# Altium schematic sheet SNC8600BMT03_SCH_v1.0.SchDoc: 1234
size A3
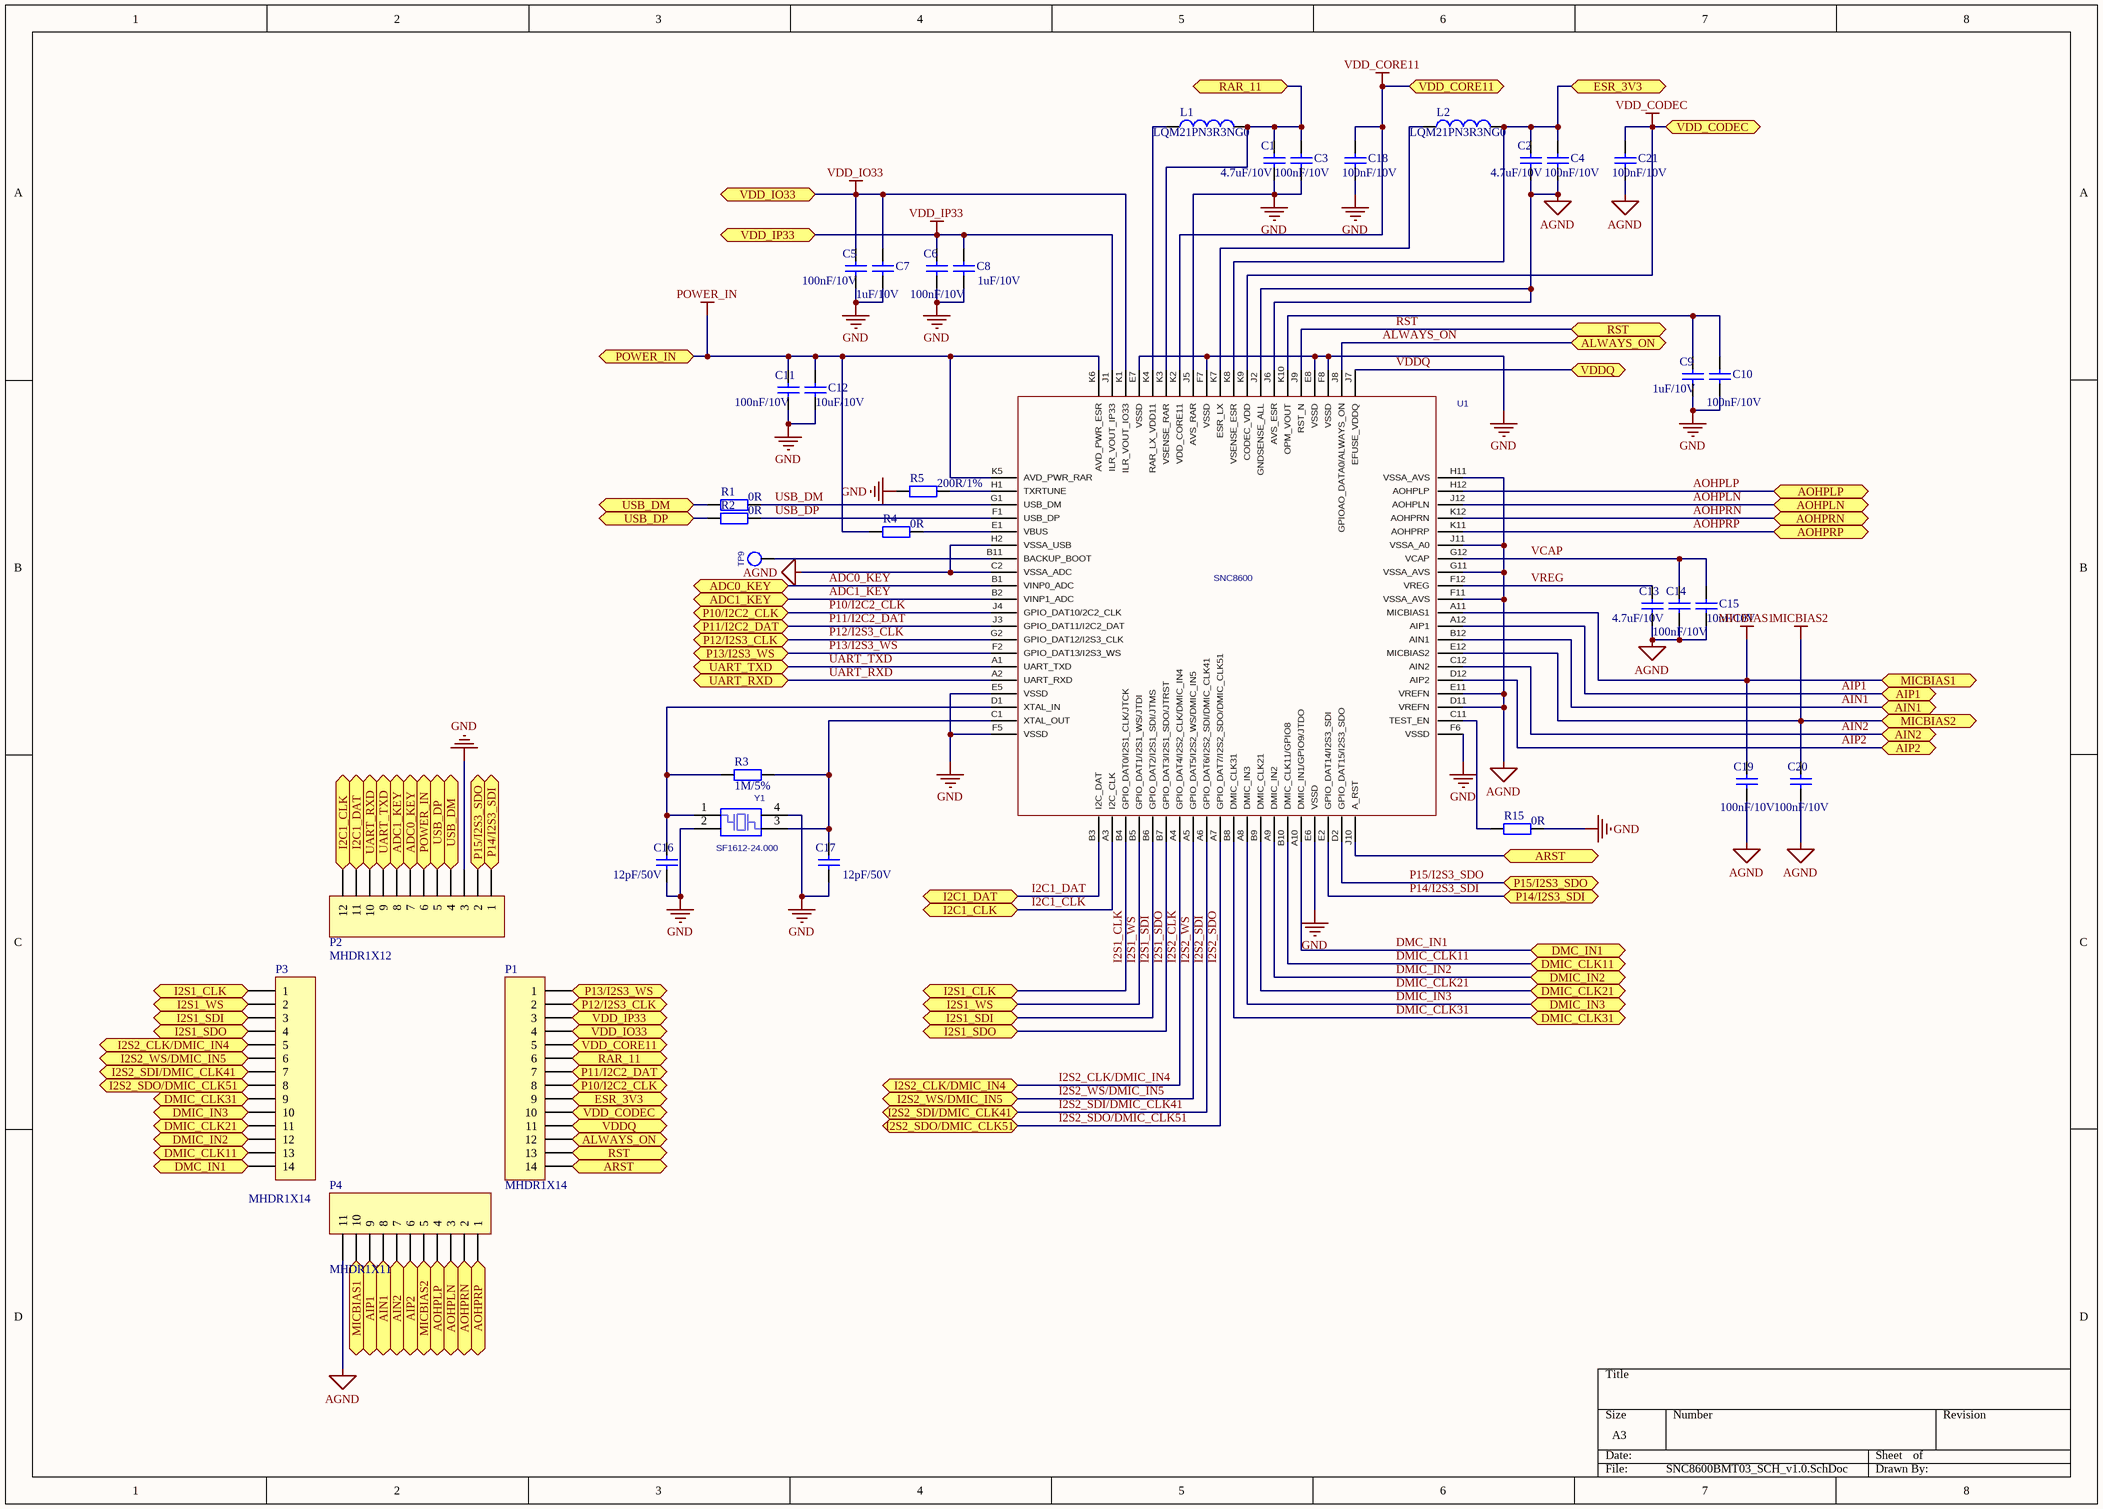
[diagram p0: SNC8600BMT03_SCH_v1.0.SchDoc]

## Parts
C1  4.7uF/10V  [C0402]
C2  4.7uF/10V  [C0402]
C3  100nF/10V  [C0402]
C4  100nF/10V  [C0402]
C5  100nF/10V  [C0402]
C6  100nF/10V  [C0402]
C7  1uF/10V  [C0402]
C8  1uF/10V  [C0402]
C9  1uF/10V  [C0402]
C10  100nF/10V  [C0402]
C11  100nF/10V  [C0402]
C12  10uF/10V  [C0402]
C13  4.7uF/10V  [C0402]
C14  100nF/10V  [C0402]
C15  10uF/10V  [C0402]
C16  12pF/50V  [0201]
C17  12pF/50V  [0201]
C18  100nF/10V  [C0402]
C19  100nF/10V  [C0402]
C20  100nF/10V  [C0402]
C21  100nF/10V  [C0402]
L1  LQM21PN3R3NG0  [L0805]
L2  LQM21PN3R3NG0  [L0805]
P1  MHDR1X14  [MHDR1X14]
P2  MHDR1X12  [MHDR1X12]
P3  MHDR1X14  [MHDR1X14]
P4  MHDR1X11  [MHDR1X11]
R1  0R  [R0402]
R2  0R  [R0402]
R3  1M/5%  [R0402]
R4  0R  [R0402]
R5  200R/1%  [R0402]
R15  0R  [R0402]
TP9  TP1  [TP1-1MM]  (value not drawn)
U1  SNC8600  [BGA0405-2]
Y1  value SF1612-24.000  [SF1612]  (hidden comment: SF1612)

## Ports
ADC0_KEY, ADC1_KEY, AIN1, AIN2, AIP1, AIP2, ALWAYS_ON, AOHPLN, AOHPLP, AOHPRN, AOHPRP, ARST, DMC_IN1, DMIC_CLK11, DMIC_CLK21, DMIC_CLK31, DMIC_IN2, DMIC_IN3, ESR_3V3, I2C1_CLK, I2C1_DAT, I2S1_CLK, I2S1_SDI, I2S1_SDO, I2S1_WS, I2S2_CLK/DMIC_IN4, I2S2_SDI/DMIC_CLK41, I2S2_SDO/DMIC_CLK51, I2S2_WS/DMIC_IN5, MICBIAS1, MICBIAS2, P10/I2C2_CLK, P11/I2C2_DAT, P12/I2S3_CLK, P13/I2S3_WS, P14/I2S3_SDI, P15/I2S3_SDO, POWER_IN, RAR_11, RST, UART_RXD, UART_TXD, USB_DM, USB_DP, VDD_CODEC, VDD_CORE11, VDD_IO33, VDD_IP33, VDDQ

## Nets
AGND: C2.1 C4.1 C13.1 C14.1 C15.1 C19.1 C20.1 C21.1 P4.11 U1.C2(VSSA_ADC) U1.D11(VREFN) U1.E11(VREFN) U1.F11(VSSA_AVS) U1.G11(VSSA_AVS) U1.H2(VSSA_USB) U1.H11(VSSA_AVS) U1.J2(GNDSENSE_ALL) U1.J6(AVS_ESR) U1.J11(VSSA_A0)
GND: C1.1 C3.1 C5.1 C6.1 C7.1 C8.1 C9.1 C10.1 C11.1 C12.1 C16.1 C17.1 C18.1 P2.3 R5.1 R15.2 U1.E5(VSSD) U1.E6(VSSD) U1.E7(VSSD) U1.E8(VSSD) U1.F5(VSSD) U1.F6(VSSD) U1.F7(VSSD) U1.F8(VSSD) U1.J5(AVS_RAR) Y1.2 Y1.4
MICBIAS1: C19.2 P4.10 U1.A11(MICBIAS1) ; port MICBIAS1
MICBIAS2: C20.2 P4.5 U1.E12(MICBIAS2) ; port MICBIAS2
POWER_IN: C11.2 C12.2 P2.6 R4.1 U1.K5(AVD_PWR_RAR) U1.K6(AVD_PWR_ESR) ; port POWER_IN
VDD_CODEC: C21.2 P1.10 U1.K9(CODEC_VDD) ; port VDD_CODEC
VDD_CORE11: C18.2 P1.5 U1.K2(VDD_CORE11) ; port VDD_CORE11
VDD_IO33: C5.2 C7.2 P1.4 U1.K1(ILR_VOUT_IO33) ; port VDD_IO33
VDD_IP33: C6.2 C8.2 P1.3 U1.J1(ILR_VOUT_IP33) ; port VDD_IP33
ADC0_KEY: P2.7 U1.B1(VINP0_ADC) ; port ADC0_KEY
ADC1_KEY: P2.8 U1.B2(VINP1_ADC) ; port ADC1_KEY
AIN1: P4.8 U1.B12(AIN1) ; port AIN1
AIN2: P4.7 U1.C12(AIN2) ; port AIN2
AIP1: P4.9 U1.A12(AIP1) ; port AIP1
AIP2: P4.6 U1.D12(AIP2) ; port AIP2
ALWAYS_ON: P1.12 U1.J8(GPIOAO_DATA0/ALWAYS_ON) ; port ALWAYS_ON
AOHPLN: P4.3 U1.J12(AOHPLN) ; port AOHPLN
AOHPLP: P4.4 U1.H12(AOHPLP) ; port AOHPLP
AOHPRN: P4.2 U1.K12(AOHPRN) ; port AOHPRN
AOHPRP: P4.1 U1.K11(AOHPRP) ; port AOHPRP
ARST: P1.14 U1.J10(A_RST) ; port ARST
DMC_IN1: P3.14 U1.A10(DMIC_IN1/GPIO9/JTDO) ; port DMC_IN1
DMIC_CLK11: P3.13 U1.B10(DMIC_CLK11/GPIO8) ; port DMIC_CLK11
DMIC_CLK21: P3.11 U1.B9(DMIC_CLK21) ; port DMIC_CLK21
DMIC_CLK31: P3.9 U1.B8(DMIC_CLK31) ; port DMIC_CLK31
DMIC_IN2: P3.12 U1.A9(DMIC_IN2) ; port DMIC_IN2
DMIC_IN3: P3.10 U1.A8(DMIC_IN3) ; port DMIC_IN3
ESR_3V3: C2.2 C4.2 L2.2 P1.9 U1.K8(VSENSE_ESR) ; port ESR_3V3
I2C1_CLK: P2.12 U1.A3(I2C_CLK) ; port I2C1_CLK
I2C1_DAT: P2.11 U1.B3(I2C_DAT) ; port I2C1_DAT
I2S1_CLK: P3.1 U1.B4(GPIO_DAT0/I2S1_CLK/JTCK) ; port I2S1_CLK
I2S1_SDI: P3.3 U1.B6(GPIO_DAT2/I2S1_SDI/JTMS) ; port I2S1_SDI
I2S1_SDO: P3.4 U1.B7(GPIO_DAT3/I2S1_SDO/JTRST) ; port I2S1_SDO
I2S1_WS: P3.2 U1.B5(GPIO_DAT1/I2S1_WS/JTDI) ; port I2S1_WS
I2S2_CLK: P3.5 U1.A4(GPIO_DAT4/I2S2_CLK/DMIC_IN4) ; port I2S2_CLK/DMIC_IN4  [also labelled I2S2_CLK/DMIC_IN4]
I2S2_SDI: P3.7 U1.A6(GPIO_DAT6/I2S2_SDI/DMIC_CLK41) ; port I2S2_SDI/DMIC_CLK41  [also labelled I2S2_SDI/DMIC_CLK41]
I2S2_SDO: P3.8 U1.A7(GPIO_DAT7/I2S2_SDO/DMIC_CLK51) ; port I2S2_SDO/DMIC_CLK51  [also labelled I2S2_SDO/DMIC_CLK51]
I2S2_WS: P3.6 U1.A5(GPIO_DAT5/I2S2_WS/DMIC_IN5) ; port I2S2_WS/DMIC_IN5  [also labelled I2S2_WS/DMIC_IN5]
P10/I2C2_CLK: P1.8 U1.J4(GPIO_DAT10/2C2_CLK) ; port P10/I2C2_CLK
P11/I2C2_DAT: P1.7 U1.J3(GPIO_DAT11/I2C2_DAT) ; port P11/I2C2_DAT
P12/I2S3_CLK: P1.2 U1.G2(GPIO_DAT12/I2S3_CLK) ; port P12/I2S3_CLK
P13/I2S3_WS: P1.1 U1.F2(GPIO_DAT13/I2S3_WS) ; port P13/I2S3_WS
P14/I2S3_SDI: P2.1 U1.E2(GPIO_DAT14/I2S3_SDI) ; port P14/I2S3_SDI
P15/I2S3_SDO: P2.2 U1.D2(GPIO_DAT15/I2S3_SDO) ; port P15/I2S3_SDO
RAR_11: C1.2 C3.2 L1.2 P1.6 U1.K3(VSENSE_RAR) ; port RAR_11
RST: P1.13 U1.J9(RST_N) ; port RST
UART_RXD: P2.10 U1.A2(UART_RXD) ; port UART_RXD
UART_TXD: P2.9 U1.A1(UART_TXD) ; port UART_TXD
USB_DM: R1.2 U1.G1(USB_DM)
USB_DM: P2.4 R1.1 ; port USB_DM  [a separate net that carries the same name]
USB_DP: R2.2 U1.F1(USB_DP)
USB_DP: P2.5 R2.1 ; port USB_DP  [a separate net that carries the same name]
VCAP: C14.2 C15.2 U1.G12(VCAP)
VDDQ: P1.11 U1.J7(EFUSE_VDDQ) ; port VDDQ
VREG: C13.2 U1.F12(VREG)
NetC9_2: C9.2 C10.2 U1.K10(OPM_VOUT)
NetC16_2: C16.2 R3.2 U1.D1(XTAL_IN) Y1.1
NetC17_2: C17.2 R3.1 U1.C1(XTAL_OUT) Y1.3
NetL1_1: L1.1 U1.K4(RAR_LX_VDD11)
NetL2_1: L2.1 U1.K7(ESR_LX)
NetR4_2: R4.2 U1.E1(VBUS)
NetR5_2: R5.2 U1.H1(TXRTUNE)
NetR15_1: R15.1 U1.C11(TEST_EN)
NetTP9_1: TP9.1 U1.B11(BACKUP_BOOT)

## Library data of the parts
C1-C21 = Cap Semi: Capacitor (Semiconductor SIM Model); Value: 100pF; Published: 8-Jun-2000; LatestRevisionDate: 29-May-2009; LatestRevisionNote: IPC-7351 Footprint Added.; PackageReference: C1206; Publisher: Altium Limited; PackageDescription: Chip Capacitor
L1 L2 = Inductor: Code_IEC: 1005; Value: 10mH; Published: 8-Jun-2000; LatestRevisionDate: 29-May-2009; LatestRevisionNote: IPC-7351 Footprint Added.; PackageReference: 0402-A; Publisher: Altium Limited; PackageDescription: Chip Inductor; Code_JEITA: 0402
P1 P3 = MHDR1X14: Header, 14-Pin; LatestRevisionDate: 17-Jul-2002; LatestRevisionNote: Re-released for DXP Platform.; Publisher: Altium Limited
P2 = MHDR1X12: Header, 12-Pin; LatestRevisionDate: 17-Jul-2002; LatestRevisionNote: Re-released for DXP Platform.; Publisher: Altium Limited
P4 = MHDR1X11: Header, 11-Pin; LatestRevisionDate: 17-Jul-2002; LatestRevisionNote: Re-released for DXP Platform.; Publisher: Altium Limited
R1 R2 R4 R5 R15 = Res2: Resistor; Value: 1K; Published: 8-Jun-2000; LatestRevisionDate: 17-Jul-2002; LatestRevisionNote: Re-released for DXP Platform.; PackageReference: AXIAL-0.4; Publisher: Altium Limited; PackageDescription: Axial Device, Thru-Hole; 2 Leads; 0.4 in Pin Spacing
R3 = Res2: Resistor; Value: 1M; Published: 8-Jun-2000; LatestRevisionDate: 17-Jul-2002; LatestRevisionNote: Re-released for DXP Platform.; PackageReference: AXIAL-0.4; Publisher: Altium Limited; PackageDescription: Axial Device, Thru-Hole; 2 Leads; 0.4 in Pin Spacing
U1 = BGA_BCHIP-ES2: Value: BCHIP; PCB DECAL: BGA0405-2
TP9 = TP1: PCB DECAL: TP1
Y1 = SF1612: PCB DECAL: SF1612